# EAGLE design OR Gate (EAGLE 6.5.0)
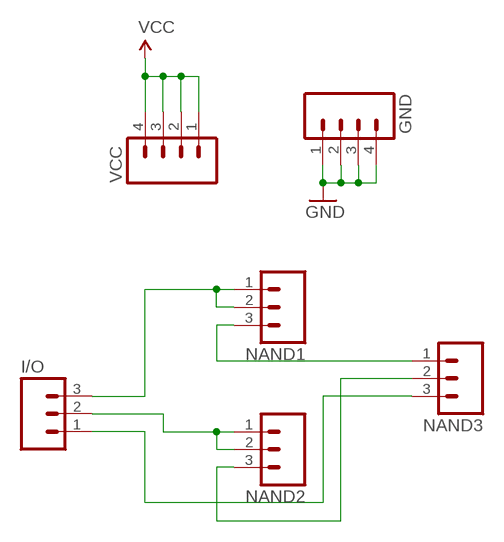
[diagram p0: schematic, sheet 1]

## Parts
GND  M04LOCK  [1X04_LOCK]
I/O  M03LOCK  [1X03_LOCK]
NAND1  M03LOCK  [1X03_LOCK]
NAND2  M03LOCK  [1X03_LOCK]
NAND3  M03LOCK  [1X03_LOCK]
VCC  M04LOCK  [1X04_LOCK]

## Nets
GND: GND.1 GND.2 GND.3 GND.4
N$1: I/O.3 NAND1.1 NAND1.2
N$2: NAND1.3 NAND3.1
N$3: I/O.1 NAND3.3
N$4: I/O.2 NAND2.1 NAND2.2
N$5: NAND2.3 NAND3.2
VCC: VCC.1 VCC.2 VCC.3 VCC.4

## Library data of the parts
GND VCC = SparkFun-Connectors:M04: Header 4 Standard 4-pin 0.1" header. Use with straight break away headers (SKU : PRT-00116), right angle break away headers (PRT-00553), swiss pins (PRT-00743), machine pins (PRT-00117), and female headers (PRT-00115). Molex polarized connector foot print use with SKU : PRT-08231 with associated crimp pins and housings. 1MM SMD Version SKU: PRT-10208
I/O NAND1-NAND3 = SparkFun-Connectors:M03: Header 3 Standard 3-pin 0.1" header. Use with straight break away headers (SKU : PRT-00116), right angle break away headers (PRT-00553), swiss pins (PRT-00743), machine pins (PRT-00117), and female headers (PRT-00115). Molex polarized connector foot print use with SKU : PRT-08232 with associated crimp pins and housings.

## Board
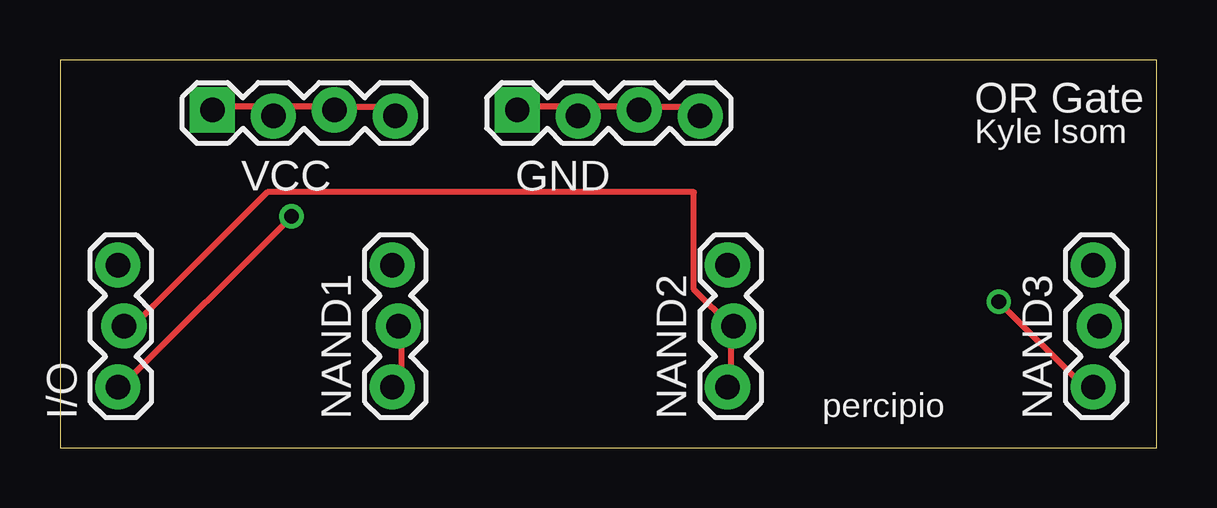
[diagram p1: board, top side]
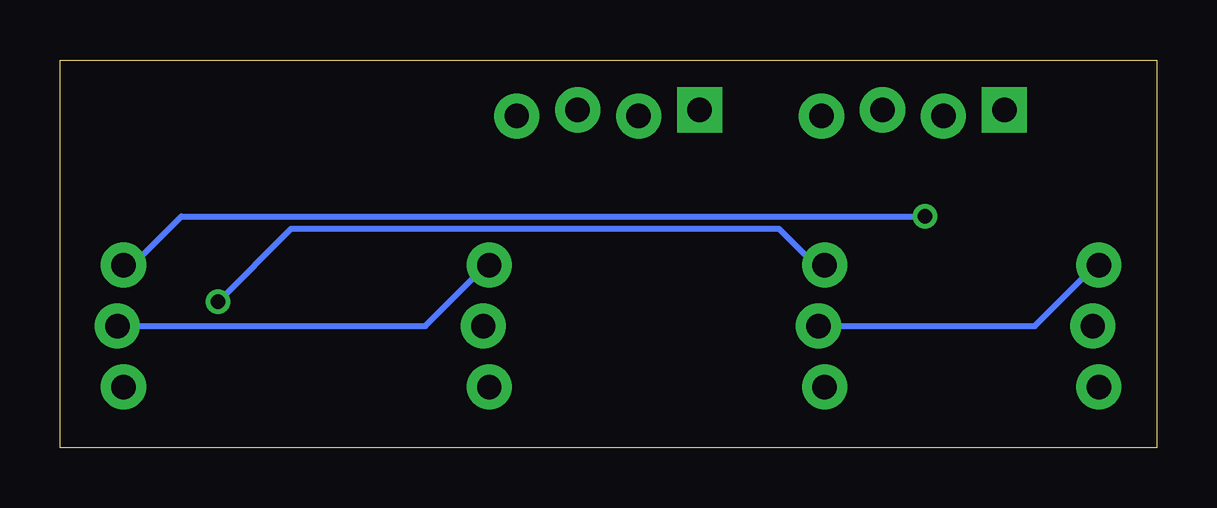
[diagram p2: board, bottom side, seen from below]

Size 45.7 x 16.18 mm. Coordinates in mm from the lower left corner, seen from the top.
Outline: 0,0 45.7,0 45.7,16.18 0,16.18 0,0
Copper layers (1*16): Top 0.035mm / dielectric 1.5mm / Bottom 0.035mm
Design rules "default": minimum track width 10mil, minimum drill 24mil, track to track 8mil, track to pad 8mil, pad to pad 8mil, via to via 8mil, smd to smd 8mil, copper to edge 40mil, drill to drill 8mil, minimum pad ring 10mil, minimum via ring 8mil, stop-mask expansion 4mil, vias tented up to drill 0mil, thermal gap 10mil

### Footprints (pad centres in the part's own frame; a part is rotated, then mirrored left to right if it is on the bottom)
1X04_LOCK = drill 1.016 pad 1.88 square: 1 0,0.127 | drill 1.016 pad 1.88: 2 2.54,-0.127; 3 5.08,0.127; 4 7.62,-0.127
1X03_LOCK = drill 1.016 pad 1.88: 1 0,0.127; 2 2.54,-0.127; 3 5.08,0.127

### Placement (x,y rotation side)
GND  19.05,13.97 0 top
I/O  2.54,2.54 90 top
NAND1  13.97,2.54 90 top
NAND2  27.94,2.54 90 top
NAND3  43.18,2.54 90 top
VCC  6.35,13.97 0 top

### Tracks (layer width: path | path; a pad name or v marks a point on that pad's centre or on a via)
GND
  Top 0.254: GND.4 26.42,14.22 24.38,14.22 GND.3 23.88,14.22 21.84,14.22 GND.2 21.34,14.22 19.3,14.22 GND.1
N$1
  Top 0.254: NAND1.1 14.22,2.54 14.22,5.08 NAND1.2
  Bottom 0.254: NAND1.2 5.08,5.08 2.54,7.62 I/O.3
N$2  (via drill 0.61)
  Top 0.254: v39.12,6.1 42.67,2.54 NAND3.1
  Bottom 0.254: v39.12,6.1 36.07,9.14 15.75,9.14 14.22,7.62 NAND1.3
N$3  (via drill 0.61)
  Top 0.254: v9.65,9.65 2.54,2.54 I/O.1
  Bottom 0.254: v9.65,9.65 40.64,9.65 42.67,7.62 NAND3.3
N$4
  Top 0.254: 27.94,5.08 26.42,6.6 26.42,10.67 8.64,10.67 3.05,5.08 I/O.2 | 27.94,5.08 27.94,2.54 NAND2.1 | 27.94,5.08 NAND2.2
N$5
  Bottom 0.254: NAND3.2 30.48,5.08 27.94,7.62 NAND2.3
VCC
  Top 0.254: VCC.4 13.72,14.22 11.68,14.22 VCC.3 11.18,14.22 9.14,14.22 VCC.2 8.64,14.22 6.6,14.22 VCC.1

### Text on the board
tPlace: OR Gate | Kyle Isom | percipio